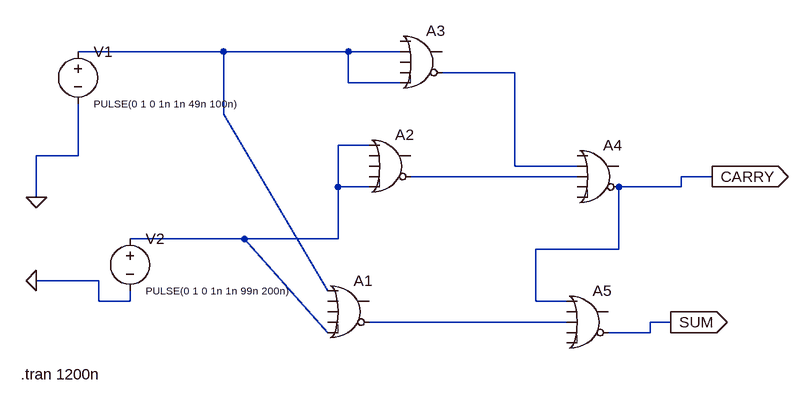
[diagram p0: schematic FA_nor.asc]
FA_nor.asc, the LTspice schematic file:
Version 4
SHEET 1 1004 680
WIRE 112 -32 -112 -32
WIRE 304 -32 112 -32
WIRE 384 -32 304 -32
WIRE 560 0 448 0
WIRE 304 16 304 -32
WIRE 384 16 304 16
WIRE 112 64 112 -32
WIRE 336 112 288 112
WIRE -112 128 -112 48
WIRE -112 128 -176 128
WIRE 560 144 560 0
WIRE 656 144 560 144
WIRE 656 160 400 160
WIRE 864 160 816 160
WIRE 288 176 288 112
WIRE 336 176 288 176
WIRE 816 176 816 160
WIRE 816 176 720 176
WIRE -176 192 -176 128
WIRE 144 256 -32 256
WIRE 288 256 288 176
WIRE 288 256 144 256
WIRE 720 272 720 176
WIRE 720 272 592 272
WIRE -80 320 -176 320
WIRE 272 336 112 64
WIRE -80 352 -80 320
WIRE -32 352 -32 336
WIRE -32 352 -80 352
WIRE 592 352 592 272
WIRE 640 352 592 352
WIRE 640 384 336 384
WIRE 800 384 768 384
WIRE 272 400 144 256
WIRE 768 400 768 384
WIRE 768 400 704 400
FLAG -176 192 0
FLAG -176 320 0
FLAG 800 384 SUM
IOPIN 800 384 Out
FLAG 864 160 CARRY
IOPIN 864 160 Out
SYMBOL Digital\\or 304 304 R0
SYMATTR InstName A1
SYMBOL Digital\\or 368 80 R0
SYMATTR InstName A2
SYMBOL Digital\\or 416 -80 R0
SYMATTR InstName A3
SYMBOL Digital\\or 688 96 R0
SYMATTR InstName A4
SYMBOL Digital\\or 672 320 R0
SYMATTR InstName A5
SYMBOL voltage -112 -48 R0
WINDOW 3 24 96 Left 1
WINDOW 123 0 0 Left 0
WINDOW 39 0 0 Left 0
SYMATTR Value PULSE(0 1 0 1n 1n 49n 100n)
SYMATTR InstName V1
SYMBOL voltage -32 240 R0
WINDOW 3 24 96 Left 1
WINDOW 123 0 0 Left 0
WINDOW 39 0 0 Left 0
SYMATTR Value PULSE(0 1 0 1n 1n 99n 200n)
SYMATTR InstName V2
TEXT -200 464 Left 2 !.tran 1200n

The netlist it stands for:
* FA_nor.asc
A1 N001 0 0 0 N003 N005 0 0 OR
A2 N003 0 0 0 N003 N004 0 0 OR
A3 0 N001 0 0 N001 N002 0 0 OR
A4 0 N002 N004 0 0 CARRY 0 0 OR
A5 CARRY 0 N005 0 0 SUM 0 0 OR
V1 N001 0 PULSE(0 1 0 1n 1n 49n 100n)
V2 N003 0 PULSE(0 1 0 1n 1n 99n 200n)
.tran 1200n
.backanno
.end